# Altium schematic sheet SCH_A3_Template.SchDoc
size A3
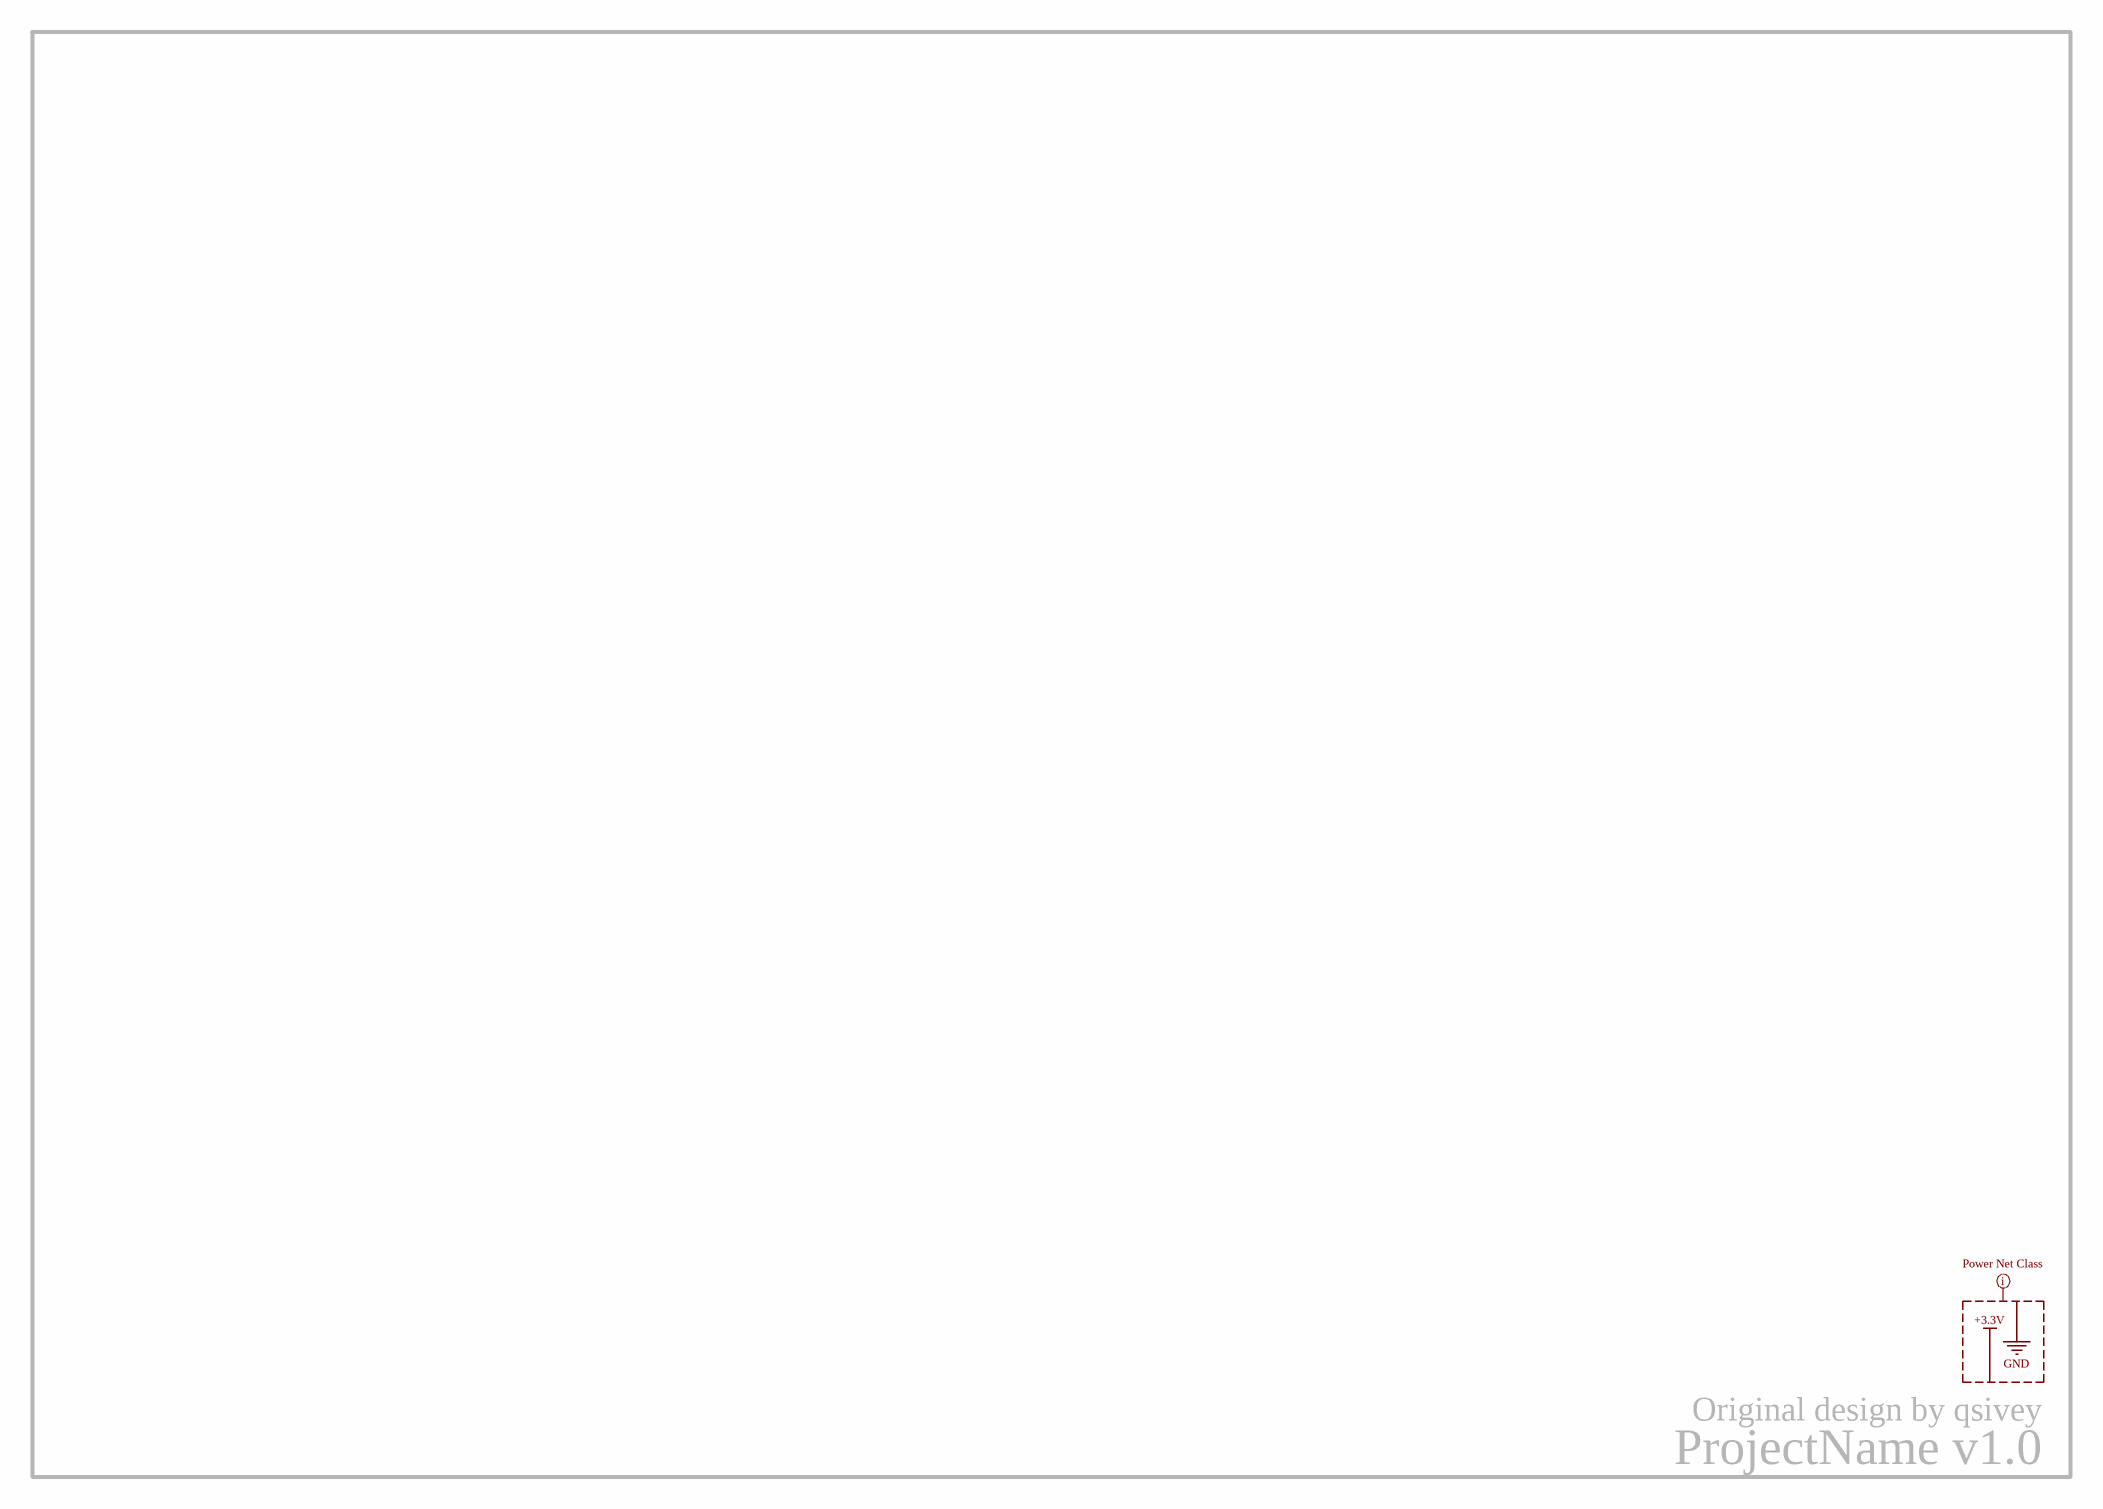
[diagram p0: SCH_A3_Template.SchDoc]

## Layout directives
net class Power: +3.3V, GND

## Notes on the sheet
- Original design by qsivey
- ProjectName v1.0